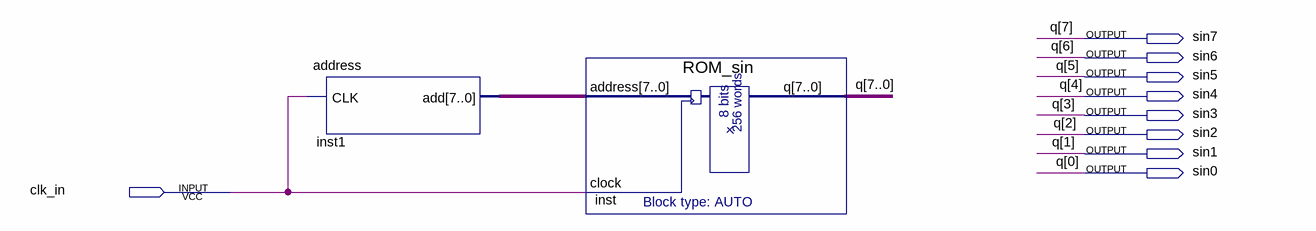
[diagram p0: schematic sheet]
// Quartus schematic sin_block.bdf as structural Verilog: 2 symbols, 9 pins
module sin_block (
  input  clk_in,
  output sin7,
  output sin6,
  output sin5,
  output sin4,
  output sin3,
  output sin2,
  output sin1,
  output sin0
);

  wire [7:0] inst1_add;

  address inst1 (.CLK(clk_in), .add(inst1_add));
  ROM_sin inst (.address(inst1_add), .clock(clk_in), .q({sin7, sin6, sin5, sin4, sin3, sin2, sin1, sin0}));

  // Other names for the same wires on the sheet: q[7:0] = {sin7, sin6, sin5, sin4, sin3, sin2, sin1, sin0}
endmodule
